# Altium schematic sheet I3C.SchDoc
size A4; DocumentNumber: 12; SheetNumber: 12; SheetTotal: 15
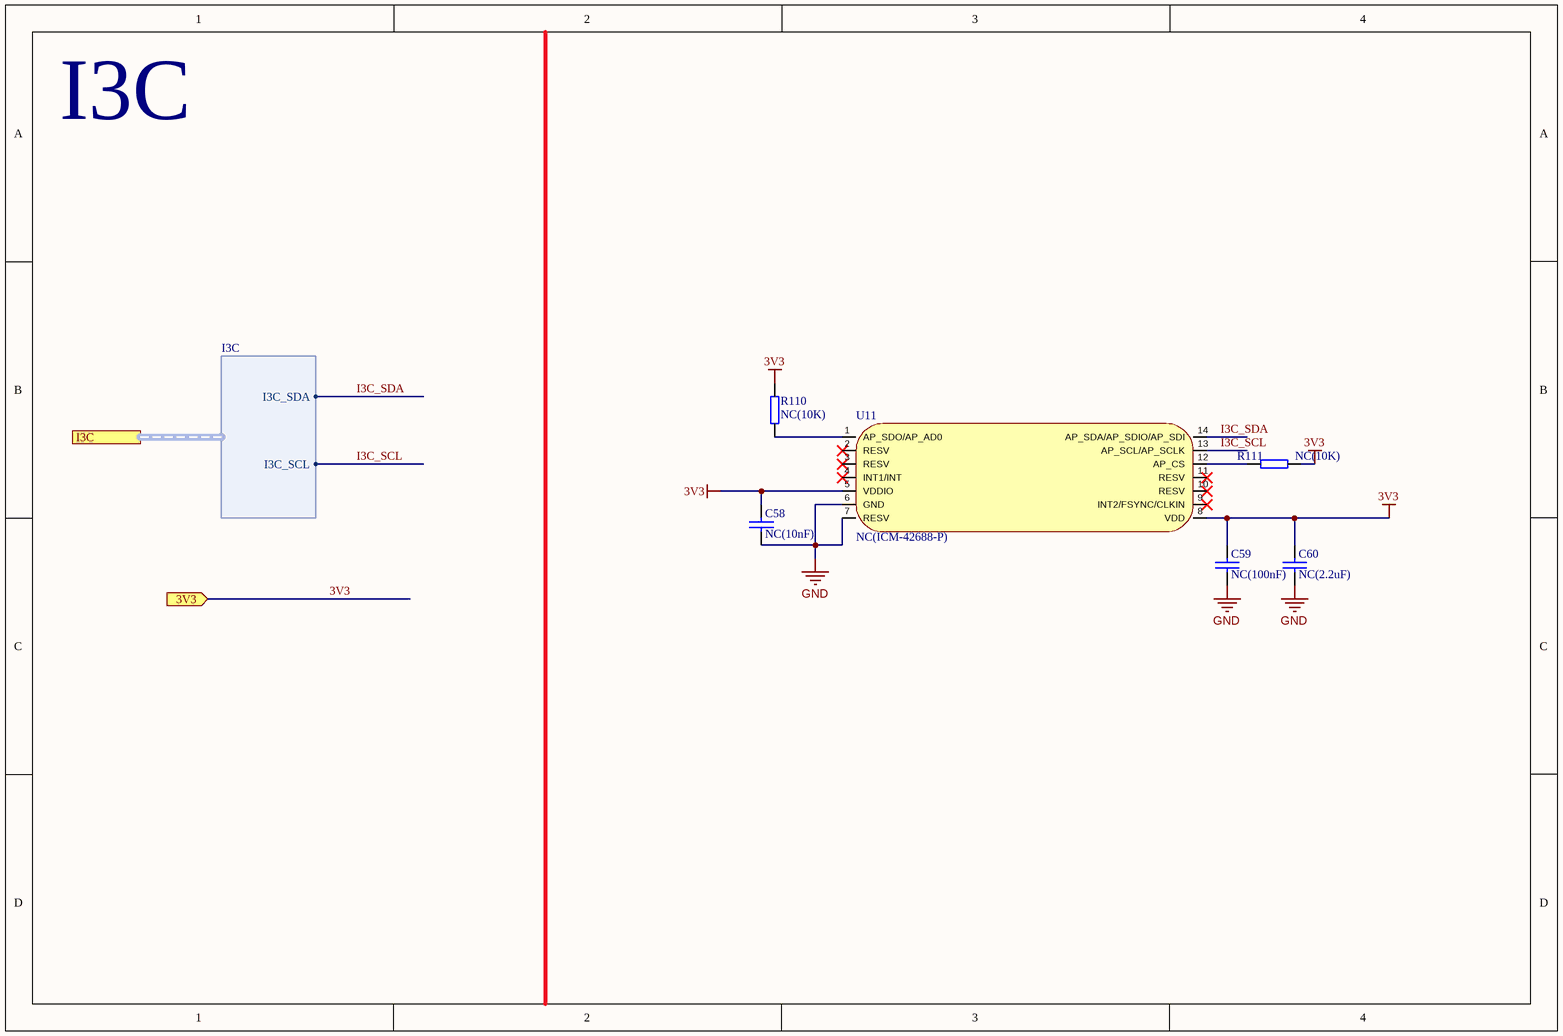
[diagram p0: I3C.SchDoc]

## Parts
C58  NC(10nF)  [0402_C]
C59  NC(100nF)  [0402_C]
C60  NC(2.2uF)  [0402_C]
R110  NC(10K)  [0402]
R111  NC(10K)  [0402]
U11  NC(ICM-42688-P)  [LGA-14_L3.0-W2.5-P0.50-TL]

## Ports
3V3 (in), I3C (harness I3C)

## Harnesses
I3C: I3C_SDA, I3C_SCL

## Nets
3V3: C58.2 C59.2 C60.2 R110.1 R111.1 U11.5(VDDIO) U11.8(VDD) ; port 3V3
GND: C58.1 C59.1 C60.1 U11.6(GND) U11.7(RESV)
I3C_SCL: U11.13(AP_SCL/AP_SCLK) ; port I3C.I3C_SCL
I3C_SDA: U11.14(AP_SDA/AP_SDIO/AP_SDI) ; port I3C.I3C_SDA
NetR110_2: R110.2 U11.1(AP_SDO/AP_AD0)
NetR111_2: R111.2 U11.12(AP_CS)

Not connected (* = marked no-connect by the designer): U11 2(RESV)* 3(RESV)* 4(INT1/INT)* 9(INT2/FSYNC/CLKIN)* 10(RESV)* 11(RESV)*

## Notes on the sheet
- I3C

## Library data of the parts
C58-C60 = CAP: Capacitor
R110 R111 = RES
U11 = ICM-42688-P